# Altium schematic sheet main.SchDoc
size A4
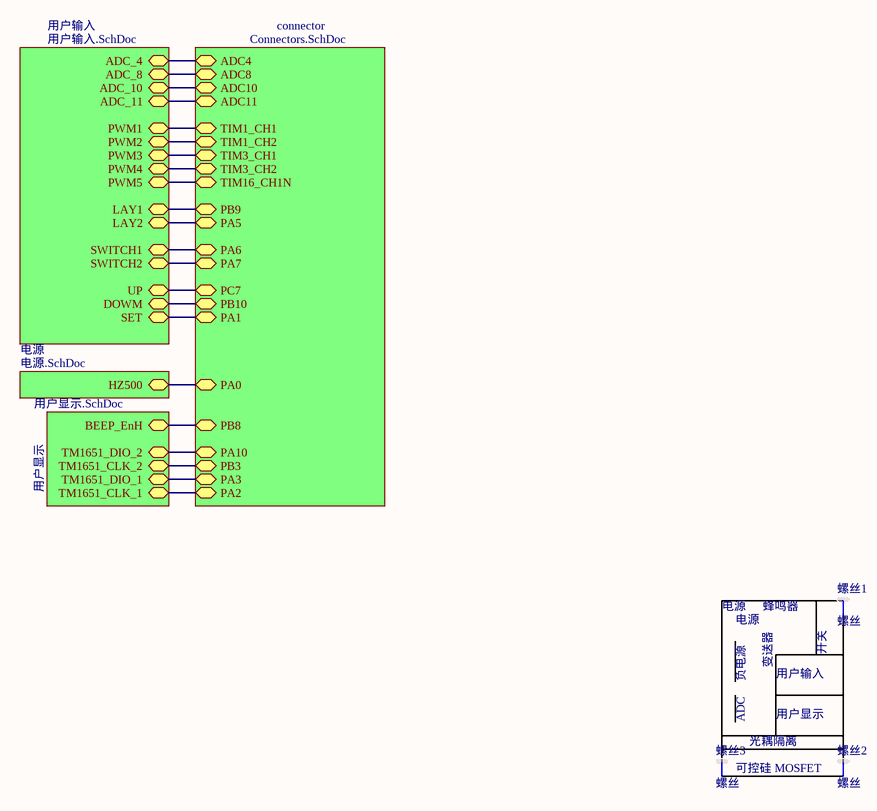
[diagram p0: main.SchDoc]

## Parts
螺丝1  螺丝  [M3_empty]
螺丝2  螺丝  [M3_empty]
螺丝3  螺丝  [M3_empty]

## Sub-sheets
connector = Connectors.SchDoc: ADC8 (bidir), ADC4 (bidir), ADC10 (bidir), ADC11 (bidir), TIM1_CH2, TIM3_CH2, TIM3_CH1, TIM1_CH1, PA2, PA3, PB3, PA10, PB10, PC7, PA0 (bidir), PB8, PB9, PA6, PA5, PA7, TIM16_CH1N, PA1
用户显示 = 用户显示.SchDoc: TM1651_CLK_1, TM1651_CLK_2, TM1651_DIO_1, TM1651_DIO_2, BEEP_EnH
用户输入 = 用户输入.SchDoc: UP, DOWM, SET, PWM1, PWM2, ADC_4, ADC_11, ADC_8, ADC_10, PWM4, PWM3, LAY2, SWITCH2, SWITCH1, LAY1, PWM5
电源 = 电源.SchDoc: HZ500

## Nets
(unnamed): sheet 用户显示/TM1651_CLK_1, sheet connector/PA2
(unnamed): sheet 用户显示/TM1651_CLK_2, sheet connector/PB3
(unnamed): sheet 用户显示/TM1651_DIO_1, sheet connector/PA3
(unnamed): sheet 用户显示/TM1651_DIO_2, sheet connector/PA10
(unnamed): sheet 用户显示/BEEP_EnH, sheet connector/PB8
(unnamed): sheet 用户输入/UP, sheet connector/PC7
(unnamed): sheet 用户输入/DOWM, sheet connector/PB10
(unnamed): sheet 用户输入/SET, sheet connector/PA1
(unnamed): sheet 用户输入/PWM1, sheet connector/TIM1_CH1
(unnamed): sheet 用户输入/PWM2, sheet connector/TIM1_CH2
(unnamed): sheet 用户输入/ADC_4, sheet connector/ADC4
(unnamed): sheet 用户输入/ADC_11, sheet connector/ADC11
(unnamed): sheet 用户输入/ADC_8, sheet connector/ADC8
(unnamed): sheet 用户输入/ADC_10, sheet connector/ADC10
(unnamed): sheet 用户输入/PWM4, sheet connector/TIM3_CH2
(unnamed): sheet 用户输入/PWM3, sheet connector/TIM3_CH1
(unnamed): sheet 用户输入/LAY2, sheet connector/PA5
(unnamed): sheet 用户输入/SWITCH2, sheet connector/PA7
(unnamed): sheet 用户输入/SWITCH1, sheet connector/PA6
(unnamed): sheet 用户输入/LAY1, sheet connector/PB9
(unnamed): sheet 用户输入/PWM5, sheet connector/TIM16_CH1N
(unnamed): sheet connector/PA0, sheet 电源/HZ500

## Notes on the sheet
- 电源
- 蜂鸣器
- 负电源
- 用户输入
- 变送器
- (near 螺丝1) 开关
- (near 螺丝3) 可控硅 MOSFET
- ADC
- (near 螺丝3) 光耦隔离
- 用户显示